# Altium schematic sheet MPPT.SchDoc
size A; SheetNumber: 1; SheetTotal: 12
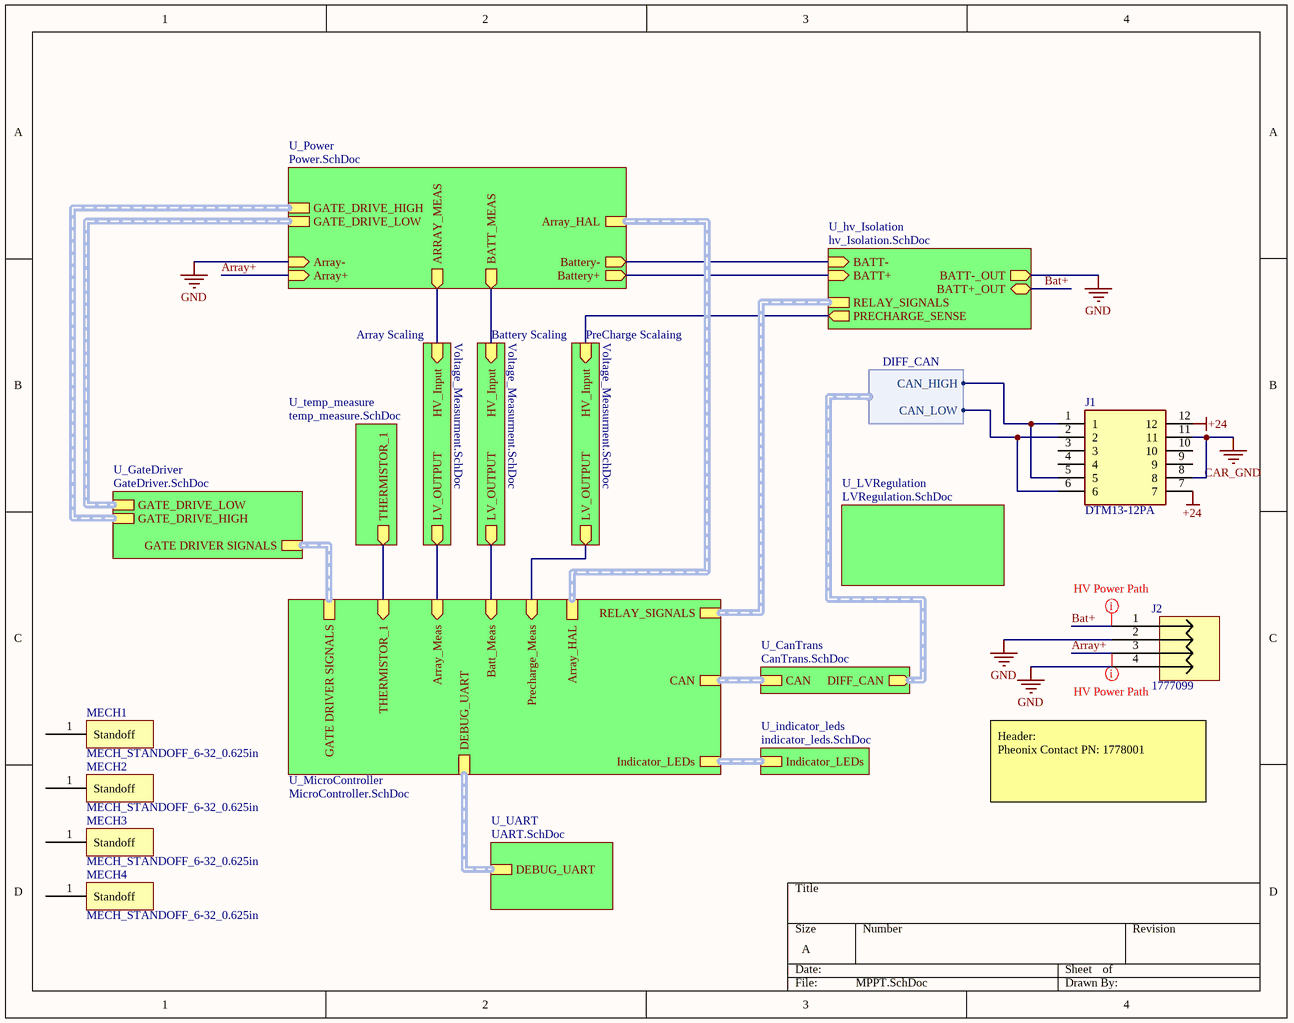
[diagram p0: MPPT.SchDoc]

## Parts
J1  DTM13-12PA  [TE_DTM13-12PA]
J2  1777099  [FP-1777099-MFG]
MECH1  MECH_STANDOFF_6-32_0.625in  [STANDOFF_6-32_0.625in]
MECH2  MECH_STANDOFF_6-32_0.625in  [STANDOFF_6-32_0.625in]
MECH3  MECH_STANDOFF_6-32_0.625in  [STANDOFF_6-32_0.625in]
MECH4  MECH_STANDOFF_6-32_0.625in  [STANDOFF_6-32_0.625in]

## Sub-sheets
Array Scaling = Voltage_Measurment.SchDoc: LV_OUTPUT (out), HV_Input (in)
Battery Scaling = Voltage_Measurment.SchDoc: LV_OUTPUT (out), HV_Input (in)
PreCharge Scalaing = Voltage_Measurment.SchDoc: LV_OUTPUT (out), HV_Input (in)
U_CanTrans = CanTrans.SchDoc: CAN (harness CAN), DIFF_CAN (out, harness DIFF_CAN)
U_GateDriver = GateDriver.SchDoc: GATE DRIVER SIGNALS (harness Gate Driver), GATE_DRIVE_HIGH (harness GATE_DRIVE), GATE_DRIVE_LOW (harness GATE_DRIVE)
U_hv_Isolation = hv_Isolation.SchDoc: BATT+_OUT (bidir), BATT-_OUT (out), BATT+ (in), BATT- (in), RELAY_SIGNALS, PRECHARGE_SENSE (out)
U_indicator_leds = indicator_leds.SchDoc: Indicator_LEDs (harness Indicator LEDs)
U_LVRegulation = LVRegulation.SchDoc: no entries
U_MicroController = MicroController.SchDoc: CAN (harness CAN), Batt_Meas (in), Array_Meas (in), GATE DRIVER SIGNALS (harness Gate Driver), RELAY_SIGNALS (harness RELAY SIGNALS), Indicator_LEDs, THERMISTOR_1 (in), Array_HAL, Precharge_Meas (in), DEBUG_UART (harness DEBUG_UART)
U_Power = Power.SchDoc: Array- (in), Array+ (in), Battery+ (out), Battery- (out), GATE_DRIVE_HIGH, GATE_DRIVE_LOW, BATT_MEAS (out), ARRAY_MEAS (out), Array_HAL (harness HAL_OUTPUT)
U_temp_measure = temp_measure.SchDoc: THERMISTOR_1 (out)
U_UART = UART.SchDoc: DEBUG_UART

## Harnesses
DIFF_CAN: CAN_HIGH, CAN_LOW

## Nets
+24: J1.7 J1.12
CAR_GND: J1.8 J1.11
GND: J2.2 J2.4 ; sheet U_Power/Array-, sheet U_hv_Isolation/BATT-_OUT
Array+: J2.3 ; sheet U_Power/Array+
Bat+: J2.1 ; sheet U_hv_Isolation/BATT+_OUT
NetJ1_1: J1.1 J1.5 ; sheet U_CanTrans/DIFF_CAN.CAN_HIGH
NetJ1_2: J1.2 J1.6 ; sheet U_CanTrans/DIFF_CAN.CAN_LOW
(unnamed): sheet U_Power/Battery+, sheet U_hv_Isolation/BATT+
(unnamed): sheet U_Power/Battery-, sheet U_hv_Isolation/BATT-
(unnamed): sheet U_Power/BATT_MEAS, sheet Battery Scaling/HV_Input
(unnamed): sheet U_Power/ARRAY_MEAS, sheet Array Scaling/HV_Input
(unnamed): sheet U_MicroController/Batt_Meas, sheet Battery Scaling/LV_OUTPUT
(unnamed): sheet U_MicroController/Array_Meas, sheet Array Scaling/LV_OUTPUT
(unnamed): sheet U_MicroController/THERMISTOR_1, sheet U_temp_measure/THERMISTOR_1
(unnamed): sheet U_MicroController/Precharge_Meas, sheet PreCharge Scalaing/LV_OUTPUT
(unnamed): sheet U_hv_Isolation/PRECHARGE_SENSE, sheet PreCharge Scalaing/HV_Input

Not connected (* = marked no-connect by the designer): J1 3 4 9 10; MECH1 1(Standoff); MECH2 1(Standoff); MECH3 1(Standoff); MECH4 1(Standoff)

## Buses and harness runs
harness sheet U_CanTrans/CAN = sheet U_MicroController/CAN
harness sheet U_GateDriver/GATE DRIVER SIGNALS = sheet U_MicroController/GATE DRIVER SIGNALS
harness sheet U_GateDriver/GATE_DRIVE_HIGH = sheet U_Power/GATE_DRIVE_HIGH
harness sheet U_GateDriver/GATE_DRIVE_LOW = sheet U_Power/GATE_DRIVE_LOW
harness sheet U_hv_Isolation/RELAY_SIGNALS = sheet U_MicroController/RELAY_SIGNALS
harness sheet U_indicator_leds/Indicator_LEDs = sheet U_MicroController/Indicator_LEDs
harness sheet U_MicroController/Array_HAL = sheet U_Power/Array_HAL
harness sheet U_MicroController/DEBUG_UART = sheet U_UART/DEBUG_UART

## Layout directives
net class High Current; net class HV: Array+, Bat+

## Notes on the sheet
- Header:
  Pheonix Contact PN: 1778001

## Library data of the parts
J1 = CMP-183-000000-3: 12 way DTM13 A key Receptacle with PCB mount and 90 degree molded pins. Sealable, with centerline pitch .165 inch/4 millimeters. Gray.; Gender: Male; Voltage Rating: 250V; Connector Type: COMBINATION LINE CONNECTOR; Max Current Rating: 11A; Mounting Technology: TH; Case/Package: 12-DIP; Pins: 12; RoHS Compliant: Yes
J2 = CMP-002-00150-1: Strip Terminal Block, 12A, 1 Row(s), 1 Deck(s); Connector Type: Through Hole; Voltage Rating: 320V; Gender: Male; Current Rating: 12A; Mounting Technology: Board; RoHS Compliant: Yes; Pins: 4; Case/Package: 4-SIP
MECH1-MECH4 = CMP-044-000005-2: Hex Standoff Threaded #6-32 Aluminum 0.625" (15.88mm) 5/8"; Design Item ID: MECH_STANDOFF_6-32_0.625in; Source: mech.SchLib